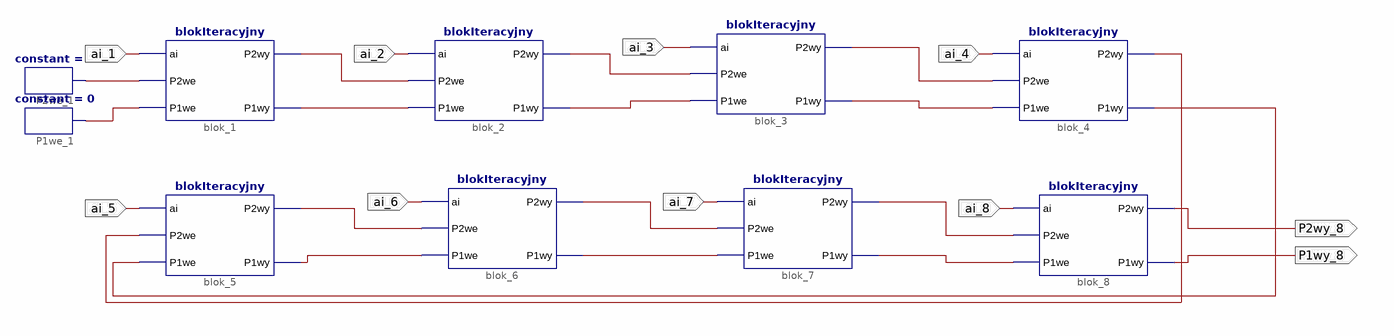
[diagram p0: schematic sheet 1]
// Xilinx ISE schematic schematUkladIteracyjny.sch (xbr) as structural Verilog: 10 symbols, 10 ports
module schematUkladIteracyjny (
  input  ai_1,
  input  ai_5,
  input  ai_6,
  input  ai_2,
  input  ai_3,
  input  ai_7,
  input  ai_4,
  input  ai_8,
  output P1wy_8,
  output P2wy_8
);

  wire XLXN_56, XLXN_57, XLXN_58, XLXN_60, XLXN_62, XLXN_63, XLXN_64, XLXN_65, XLXN_66, XLXN_67, XLXN_68,
       XLXN_69, XLXN_70, XLXN_71, XLXN_78, XLXN_79;

  blokIteracyjny blok_1 (.ai(ai_1), .P2we(XLXN_78), .P1we(XLXN_79), .P2wy(XLXN_56), .P1wy(XLXN_57));
  blokIteracyjny blok_5 (.ai(ai_5), .P2we(XLXN_68), .P1we(XLXN_69), .P2wy(XLXN_58), .P1wy(XLXN_60));
  blokIteracyjny blok_2 (.ai(ai_2), .P2we(XLXN_56), .P1we(XLXN_57), .P2wy(XLXN_62), .P1wy(XLXN_63));
  blokIteracyjny blok_6 (.ai(ai_6), .P2we(XLXN_58), .P1we(XLXN_60), .P2wy(XLXN_64), .P1wy(XLXN_65));
  blokIteracyjny blok_3 (.ai(ai_3), .P2we(XLXN_62), .P1we(XLXN_63), .P2wy(XLXN_66), .P1wy(XLXN_67));
  blokIteracyjny blok_7 (.ai(ai_7), .P2we(XLXN_64), .P1we(XLXN_65), .P2wy(XLXN_70), .P1wy(XLXN_71));
  blokIteracyjny blok_4 (.ai(ai_4), .P2we(XLXN_66), .P1we(XLXN_67), .P2wy(XLXN_68), .P1wy(XLXN_69));
  blokIteracyjny blok_8 (.ai(ai_8), .P2we(XLXN_70), .P1we(XLXN_71), .P2wy(P2wy_8), .P1wy(P1wy_8));
  constant #(.CValue("0")) P2we_1 (.O(XLXN_78));
  constant #(.CValue("0")) P1we_1 (.O(XLXN_79));
endmodule
